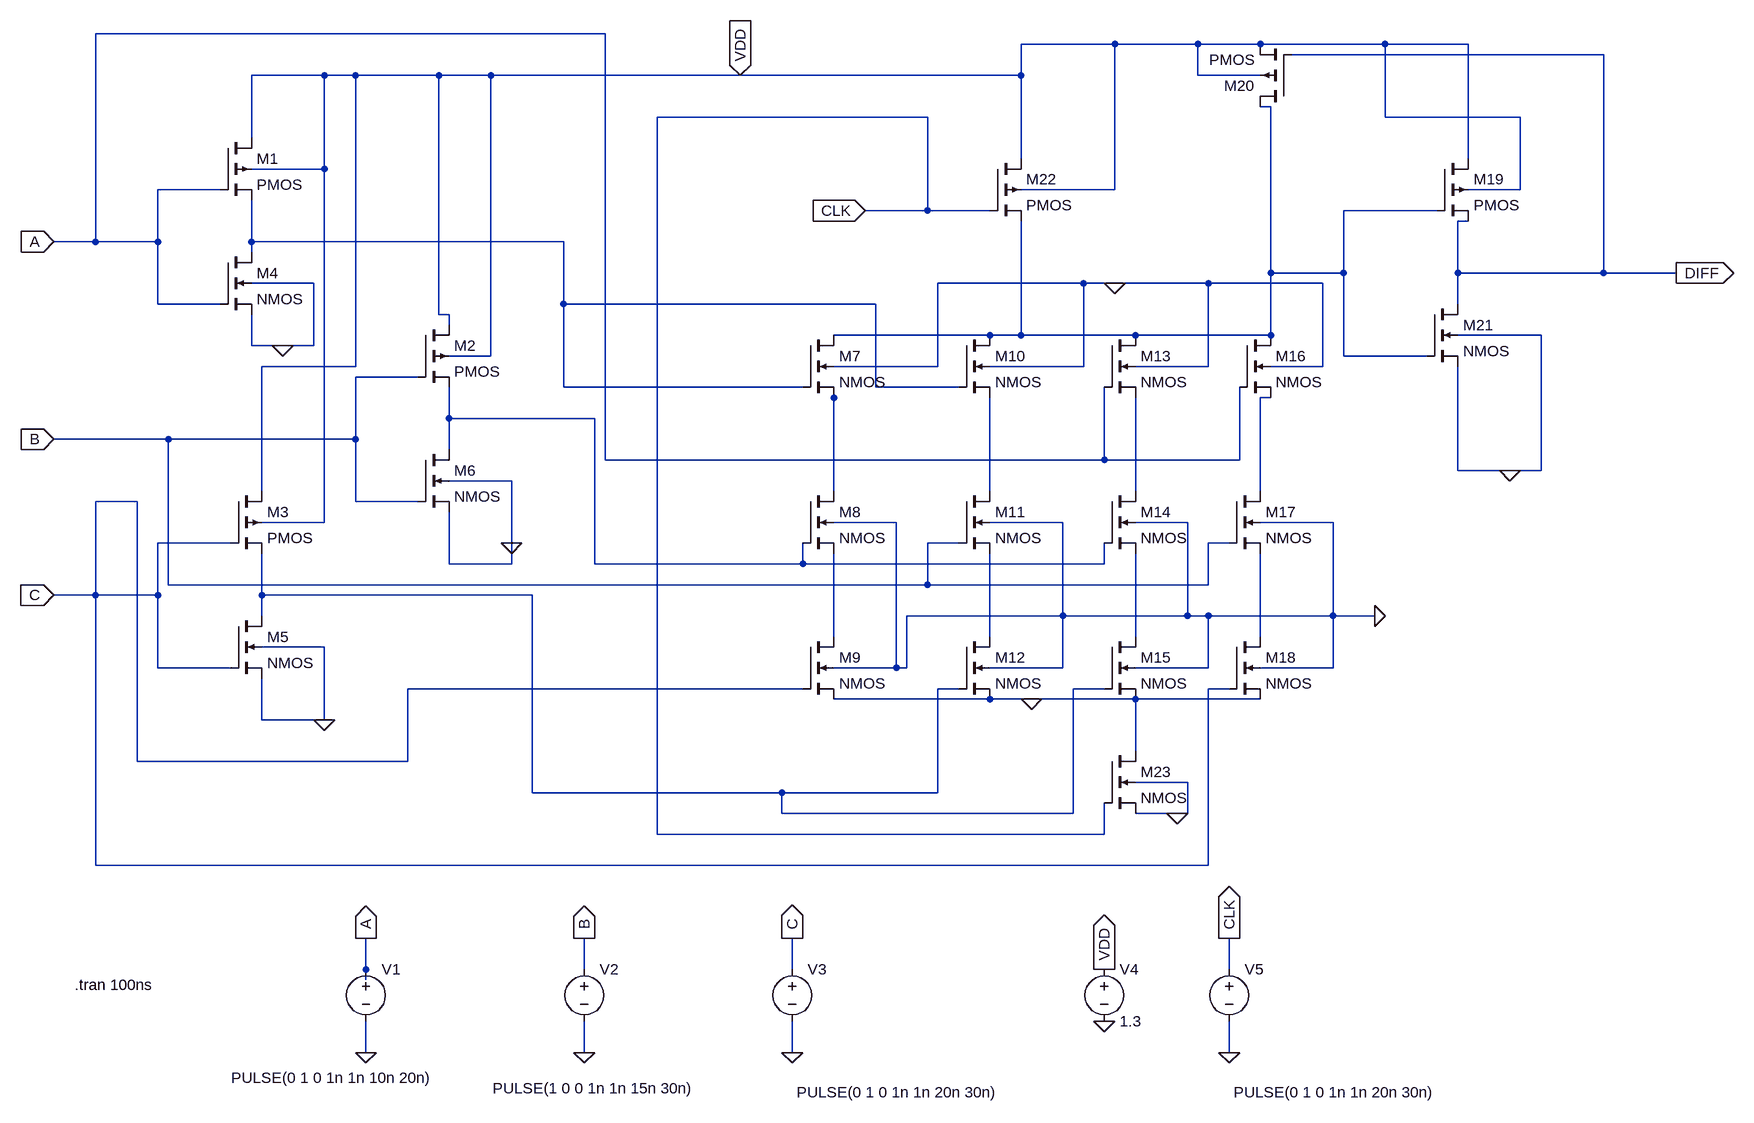
[diagram p0: schematic FULL SUB DIFF CIRCUIT.asc]
FULL SUB DIFF CIRCUIT.asc, the LTspice schematic file:
Version 4
SHEET 1 2540 1580
WIRE 800 -64 16 -64
WIRE 1584 -48 1440 -48
WIRE 1712 -48 1584 -48
WIRE 1808 -48 1712 -48
WIRE 2000 -48 1808 -48
WIRE 2128 -48 2000 -48
WIRE 2336 -32 1856 -32
WIRE 368 0 256 0
WIRE 416 0 368 0
WIRE 544 0 416 0
WIRE 624 0 544 0
WIRE 1008 0 624 0
WIRE 1440 0 1440 -48
WIRE 1440 0 1008 0
WIRE 1712 0 1712 -48
WIRE 1808 0 1712 0
WIRE 1824 48 1808 48
WIRE 1296 64 880 64
WIRE 2000 64 2000 -48
WIRE 2208 64 2000 64
WIRE 256 96 256 0
WIRE 1440 128 1440 0
WIRE 2128 128 2128 -48
WIRE 368 144 368 0
WIRE 368 144 256 144
WIRE 208 176 112 176
WIRE 1584 176 1584 -48
WIRE 1584 176 1440 176
WIRE 2208 176 2208 64
WIRE 2208 176 2128 176
WIRE 1296 208 1296 64
WIRE 1296 208 1200 208
WIRE 1392 208 1296 208
WIRE 2080 208 1936 208
WIRE 2128 224 2112 224
WIRE 16 256 16 -64
WIRE 16 256 -48 256
WIRE 112 256 112 176
WIRE 112 256 16 256
WIRE 256 256 256 192
WIRE 736 256 256 256
WIRE 256 272 256 256
WIRE 1824 304 1824 48
WIRE 1936 304 1936 208
WIRE 1936 304 1824 304
WIRE 2112 304 2112 224
WIRE 2336 304 2336 -32
WIRE 2336 304 2112 304
WIRE 2448 304 2336 304
WIRE 352 320 256 320
WIRE 1536 320 1312 320
WIRE 1584 320 1536 320
WIRE 1728 320 1584 320
WIRE 1904 320 1728 320
WIRE 112 352 112 256
WIRE 208 352 112 352
WIRE 736 352 736 256
WIRE 1216 352 736 352
WIRE 2112 352 2112 304
WIRE 544 368 544 0
WIRE 560 368 544 368
WIRE 560 384 560 368
WIRE 1392 400 1152 400
WIRE 1440 400 1440 224
WIRE 1440 400 1392 400
WIRE 1616 400 1440 400
WIRE 1824 400 1824 304
WIRE 1824 400 1616 400
WIRE 2240 400 2112 400
WIRE 256 416 256 368
WIRE 304 416 256 416
WIRE 352 416 352 320
WIRE 352 416 304 416
WIRE 624 432 624 0
WIRE 624 432 560 432
WIRE 1936 432 1936 304
WIRE 2064 432 1936 432
WIRE 416 448 416 0
WIRE 416 448 272 448
WIRE 1312 448 1312 320
WIRE 1312 448 1152 448
WIRE 1536 448 1536 320
WIRE 1536 448 1392 448
WIRE 1728 448 1728 320
WIRE 1728 448 1616 448
WIRE 1904 448 1904 320
WIRE 1904 448 1824 448
WIRE 512 464 416 464
WIRE 736 480 736 352
WIRE 1104 480 736 480
WIRE 1216 480 1216 352
WIRE 1344 480 1216 480
WIRE 1152 496 1152 480
WIRE 1824 496 1808 496
WIRE 560 528 560 480
WIRE 784 528 560 528
WIRE 128 560 -48 560
WIRE 416 560 416 464
WIRE 416 560 128 560
WIRE 560 576 560 528
WIRE 800 592 800 -64
WIRE 1568 592 1568 480
WIRE 1568 592 800 592
WIRE 1776 592 1776 480
WIRE 1776 592 1568 592
WIRE 2112 608 2112 448
WIRE 2192 608 2112 608
WIRE 2240 608 2240 400
WIRE 2240 608 2192 608
WIRE 656 624 560 624
WIRE 272 640 272 448
WIRE 1152 640 1152 496
WIRE 1392 640 1392 496
WIRE 1616 640 1616 496
WIRE 1808 640 1808 496
WIRE 80 656 16 656
WIRE 416 656 416 560
WIRE 512 656 416 656
WIRE 368 688 368 144
WIRE 368 688 272 688
WIRE 1248 688 1152 688
WIRE 1504 688 1392 688
WIRE 1696 688 1616 688
WIRE 1920 688 1808 688
WIRE 224 720 112 720
WIRE 656 720 656 624
WIRE 1344 720 1296 720
WIRE 1760 720 1728 720
WIRE 560 752 560 672
WIRE 656 752 656 720
WIRE 656 752 560 752
WIRE 784 752 784 528
WIRE 1104 752 1104 720
WIRE 1104 752 784 752
WIRE 1568 752 1568 720
WIRE 1568 752 1104 752
WIRE 128 784 128 560
WIRE 1296 784 1296 720
WIRE 1296 784 128 784
WIRE 1728 784 1728 720
WIRE 1728 784 1296 784
WIRE 16 800 16 656
WIRE 16 800 -48 800
WIRE 112 800 112 720
WIRE 112 800 16 800
WIRE 272 800 272 736
WIRE 688 800 272 800
WIRE 272 832 272 800
WIRE 1504 832 1504 688
WIRE 1504 832 1264 832
WIRE 1696 832 1696 688
WIRE 1696 832 1504 832
WIRE 1728 832 1696 832
WIRE 1920 832 1920 688
WIRE 1920 832 1728 832
WIRE 1984 832 1920 832
WIRE 1152 864 1152 736
WIRE 1392 864 1392 736
WIRE 1616 864 1616 736
WIRE 1808 864 1808 736
WIRE 368 880 272 880
WIRE 112 912 112 800
WIRE 224 912 112 912
WIRE 1248 912 1248 688
WIRE 1248 912 1152 912
WIRE 1264 912 1264 832
WIRE 1264 912 1248 912
WIRE 1504 912 1504 832
WIRE 1504 912 1392 912
WIRE 1728 912 1728 832
WIRE 1728 912 1616 912
WIRE 1920 912 1920 832
WIRE 1920 912 1808 912
WIRE 1104 944 496 944
WIRE 1344 944 1312 944
WIRE 1568 944 1520 944
WIRE 1760 944 1728 944
WIRE 1392 960 1152 960
WIRE 1456 960 1392 960
WIRE 1616 960 1456 960
WIRE 1808 960 1616 960
WIRE 272 992 272 928
WIRE 368 992 368 880
WIRE 368 992 272 992
WIRE 1616 1040 1616 960
WIRE 80 1056 80 656
WIRE 496 1056 496 944
WIRE 496 1056 80 1056
WIRE 1696 1088 1616 1088
WIRE 688 1104 688 800
WIRE 1072 1104 688 1104
WIRE 1312 1104 1312 944
WIRE 1312 1104 1072 1104
WIRE 1072 1136 1072 1104
WIRE 1520 1136 1520 944
WIRE 1520 1136 1072 1136
WIRE 1680 1136 1616 1136
WIRE 1696 1136 1696 1088
WIRE 1696 1136 1680 1136
WIRE 880 1168 880 64
WIRE 1568 1168 1568 1120
WIRE 1568 1168 880 1168
WIRE 16 1216 16 800
WIRE 1728 1216 1728 944
WIRE 1728 1216 16 1216
WIRE 432 1376 432 1328
WIRE 768 1376 768 1328
WIRE 1088 1376 1088 1328
WIRE 1760 1376 1760 1328
WIRE 432 1392 432 1376
WIRE 432 1504 432 1456
WIRE 768 1504 768 1456
WIRE 1088 1504 1088 1456
WIRE 1760 1504 1760 1456
FLAG 1200 208 CLK
IOPIN 1200 208 In
FLAG -48 256 A
IOPIN -48 256 In
FLAG -48 560 B
IOPIN -48 560 In
FLAG -48 800 C
IOPIN -48 800 In
FLAG 2448 304 DIFF
IOPIN 2448 304 Out
FLAG 1984 832 0
FLAG 1680 1136 0
FLAG 2192 608 0
FLAG 1008 0 VDD
IOPIN 1008 0 In
FLAG 1584 320 0
FLAG 304 416 0
FLAG 656 720 0
FLAG 368 992 0
FLAG 432 1328 A
IOPIN 432 1328 Out
FLAG 432 1504 0
FLAG 768 1504 0
FLAG 1088 1504 0
FLAG 768 1328 B
IOPIN 768 1328 Out
FLAG 1088 1328 C
IOPIN 1088 1328 Out
FLAG 1568 1376 VDD
IOPIN 1568 1376 Out
FLAG 1568 1456 0
FLAG 1760 1504 0
FLAG 1760 1328 CLK
IOPIN 1760 1328 Out
FLAG 1456 960 0
SYMBOL pmos4 208 96 R0
SYMATTR InstName M1
SYMBOL pmos4 512 384 R0
SYMATTR InstName M2
SYMBOL pmos4 224 640 R0
SYMATTR InstName M3
SYMBOL nmos4 208 272 R0
SYMATTR InstName M4
SYMBOL nmos4 224 832 R0
SYMATTR InstName M5
SYMBOL nmos4 512 576 R0
SYMATTR InstName M6
SYMBOL nmos4 1104 400 R0
SYMATTR InstName M7
SYMBOL nmos4 1104 640 R0
SYMATTR InstName M8
SYMBOL nmos4 1104 864 R0
SYMATTR InstName M9
SYMBOL nmos4 1344 400 R0
SYMATTR InstName M10
SYMBOL nmos4 1344 640 R0
SYMATTR InstName M11
SYMBOL nmos4 1344 864 R0
SYMATTR InstName M12
SYMBOL nmos4 1568 400 R0
SYMATTR InstName M13
SYMBOL nmos4 1568 640 R0
SYMATTR InstName M14
SYMBOL nmos4 1568 864 R0
SYMATTR InstName M15
SYMBOL nmos4 1776 400 R0
SYMATTR InstName M16
SYMBOL nmos4 1760 640 R0
SYMATTR InstName M17
SYMBOL nmos4 1760 864 R0
SYMATTR InstName M18
SYMBOL pmos4 2080 128 R0
SYMATTR InstName M19
SYMBOL pmos4 1856 48 R180
SYMATTR InstName M20
SYMBOL nmos4 2064 352 R0
SYMATTR InstName M21
SYMBOL pmos4 1392 128 R0
SYMATTR InstName M22
SYMBOL nmos4 1568 1040 R0
SYMATTR InstName M23
SYMBOL voltage 432 1360 R0
WINDOW 3 -207 183 Left 2
SYMATTR Value PULSE(0 1 0 1n 1n 10n 20n)
SYMATTR InstName V1
SYMBOL voltage 768 1360 R0
WINDOW 3 -141 199 Left 2
SYMATTR Value PULSE(1 0 0 1n 1n 15n 30n)
SYMATTR InstName V2
SYMBOL voltage 1088 1360 R0
WINDOW 3 7 205 Left 2
SYMATTR Value PULSE(0 1 0 1n 1n 20n 30n)
SYMATTR InstName V3
SYMBOL voltage 1568 1360 R0
SYMATTR InstName V4
SYMATTR Value 1.3
SYMBOL voltage 1760 1360 R0
WINDOW 3 7 205 Left 2
SYMATTR Value PULSE(0 1 0 1n 1n 20n 30n)
SYMATTR InstName V5
TEXT -16 1400 Left 2 !.tran 100ns

The netlist it stands for:
* FULL SUB DIFF CIRCUIT.asc
M1 VDD A N002 VDD PMOS
M2 VDD B N005 VDD PMOS
M3 VDD C N008 VDD PMOS
M4 N002 A 0 0 NMOS
M5 N008 C 0 0 NMOS
M6 N005 B 0 0 NMOS
M7 N001 N002 N003 0 NMOS
M8 N003 N005 N009 0 NMOS
M9 N009 C 0 0 NMOS
M10 N001 N002 N006 0 NMOS
M11 N006 B N010 0 NMOS
M12 N010 N008 0 0 NMOS
M13 N001 A N007 0 NMOS
M14 N007 N005 N011 0 NMOS
M15 N011 N008 0 0 NMOS
M16 N001 A N004 0 NMOS
M17 N004 B N012 0 NMOS
M18 N012 C 0 0 NMOS
M19 VDD N001 DIFF VDD PMOS
M20 N001 DIFF VDD VDD PMOS
M21 DIFF N001 0 0 NMOS
M22 VDD CLK N001 VDD PMOS
M23 0 CLK 0 0 NMOS
V1 A 0 PULSE(0 1 0 1n 1n 10n 20n)
V2 B 0 PULSE(1 0 0 1n 1n 15n 30n)
V3 C 0 PULSE(0 1 0 1n 1n 20n 30n)
V4 VDD 0 1.3
V5 CLK 0 PULSE(0 1 0 1n 1n 20n 30n)
.model NMOS NMOS
.model PMOS PMOS
.lib standard.mos
.tran 100ns
.backanno
.end